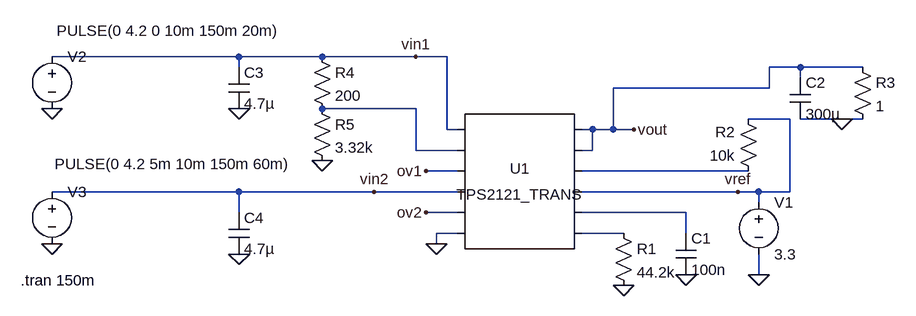
[diagram p0: schematic load-switch.asc]
load-switch.asc, the LTspice schematic file:
Version 4
SHEET 1 880 708
WIRE -208 -48 -496 -48
WIRE -80 -48 -208 -48
WIRE 64 -48 -80 -48
WIRE 112 -48 64 -48
WIRE -208 -32 -208 -48
WIRE 656 -32 608 -32
WIRE 752 -32 656 -32
WIRE 656 -16 656 -32
WIRE 608 0 608 -32
WIRE 608 0 368 0
WIRE 64 32 -80 32
WIRE 640 48 576 48
WIRE 720 48 656 48
WIRE 752 48 720 48
WIRE 112 64 112 -48
WIRE 128 64 112 64
WIRE 336 64 320 64
WIRE 368 64 368 0
WIRE 368 64 336 64
WIRE 400 64 368 64
WIRE 64 96 64 32
WIRE 128 96 64 96
WIRE 336 96 336 64
WIRE 336 96 320 96
WIRE 128 128 80 128
WIRE 576 128 320 128
WIRE -208 160 -496 160
WIRE 0 160 -208 160
WIRE 128 160 0 160
WIRE 560 160 320 160
WIRE 592 160 560 160
WIRE 640 160 640 48
WIRE 640 160 592 160
WIRE 592 176 592 160
WIRE -208 192 -208 160
WIRE 128 192 80 192
WIRE 480 192 320 192
WIRE 128 224 96 224
WIRE 384 224 320 224
WIRE 480 224 480 192
WIRE 96 240 96 224
WIRE 592 288 592 256
FLAG 400 64 vout
FLAG 720 48 0
FLAG 592 288 0
FLAG 384 304 0
FLAG 480 288 0
FLAG -80 112 0
FLAG -496 32 0
FLAG -496 240 0
FLAG 64 -48 vin1
FLAG 0 160 vin2
FLAG -208 32 0
FLAG -208 256 0
FLAG 96 240 0
FLAG 80 128 ov1
FLAG 80 192 ov2
FLAG 560 160 vref
SYMBOL AutoGenerated\\TPS2121_TRANS 224 144 R0
SYMATTR InstName U1
SYMBOL res 368 208 R0
SYMATTR InstName R1
SYMATTR Value 44.2k
SYMBOL cap 464 224 R0
SYMATTR InstName C1
SYMATTR Value 100n
SYMBOL res 592 144 R180
WINDOW 0 36 76 Left 2
WINDOW 3 36 40 Left 2
SYMATTR InstName R2
SYMATTR Value 10k
SYMBOL cap 640 -16 R0
SYMATTR InstName C2
SYMATTR Value 300µ
SYMBOL res 736 -48 R0
SYMATTR InstName R3
SYMATTR Value 1
SYMBOL voltage 592 160 R0
WINDOW 123 0 0 Left 0
WINDOW 39 0 0 Left 0
SYMATTR InstName V1
SYMATTR Value 3.3
SYMBOL res -96 -64 R0
SYMATTR InstName R4
SYMATTR Value 200
SYMBOL res -96 16 R0
SYMATTR InstName R5
SYMATTR Value 3.32k
SYMBOL voltage -496 -64 R0
WINDOW 123 0 0 Left 0
WINDOW 39 0 0 Left 0
WINDOW 3 7 -24 Left 2
SYMATTR InstName V2
SYMATTR Value PULSE(0 4.2 0 10m 150m 20m)
SYMBOL voltage -496 144 R0
WINDOW 123 0 0 Left 0
WINDOW 39 0 0 Left 0
WINDOW 3 4 -27 Left 2
SYMATTR InstName V3
SYMATTR Value PULSE(0 4.2 5m 10m 150m 60m)
SYMBOL cap -224 -32 R0
SYMATTR InstName C3
SYMATTR Value 4.7µ
SYMBOL cap -224 192 R0
SYMATTR InstName C4
SYMATTR Value 4.7µ
TEXT -544 296 Left 2 !.tran 150m

The netlist it stands for:
* load-switch.asc
* U1: TPS2121_TRANS (symbol AutoGenerated\TPS2121_TRANS not available, pins judged from their places): pin1=vin1 pin2=N001 pin3=ov1 pin4=vin2 pin5=ov2 pin6=0 pin7=vout pin8=vout pin9=N002 pin10=vref pin11=N003 pin12=N004
R1 N004 0 44.2k
C1 N003 0 100n
R2 N002 vref 10k
C2 vout 0 300µ
R3 vout 0 1
V1 vref 0 3.3
R4 vin1 N001 200
R5 N001 0 3.32k
V2 vin1 0 PULSE(0 4.2 0 10m 150m 20m)
V3 vin2 0 PULSE(0 4.2 5m 10m 150m 60m)
C3 vin1 0 4.7µ
C4 vin2 0 4.7µ
.tran 150m
.backanno
.end